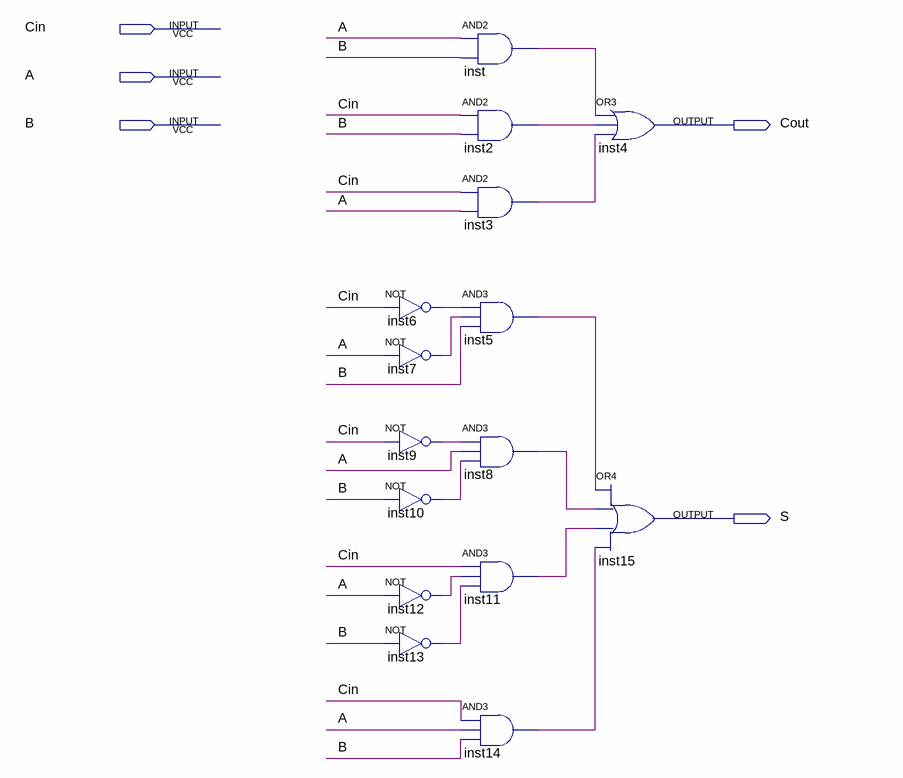
[diagram p0: schematic sheet]
// Quartus schematic FA.bdf as structural Verilog: 15 symbols, 5 pins
module FA (
  input  Cin,
  input  A,
  input  B,
  output Cout,
  output S
);

  wire inst2_out, inst3_out, inst5_out, inst6_out, inst7_out, inst8_out, inst9_out, inst10_out, inst11_out,
       inst12_out, inst13_out, inst14_out, inst_out;

  not inst6 (inst6_out, Cin);
  not inst7 (inst7_out, A);
  not inst9 (inst9_out, Cin);
  not inst10 (inst10_out, B);
  not inst12 (inst12_out, A);
  not inst13 (inst13_out, B);
  and inst (inst_out, A, B);
  and inst2 (inst2_out, Cin, B);
  and inst3 (inst3_out, Cin, A);
  and inst5 (inst5_out, inst6_out, inst7_out, B);
  and inst8 (inst8_out, inst9_out, A, inst10_out);
  and inst11 (inst11_out, Cin, inst12_out, inst13_out);
  and inst14 (inst14_out, Cin, A, B);
  or inst4 (Cout, inst_out, inst2_out, inst3_out);
  or inst15 (S, inst5_out, inst8_out, inst11_out, inst14_out);
endmodule
